# EasyEDA schematic Smart Controler Lolin D32.json
TITLE: Main Schematics; REV: 1.0; Date: 2019-06-09; Sheet: 1/1; Drawn By: Clément TOCHE; Company: Toche Corp
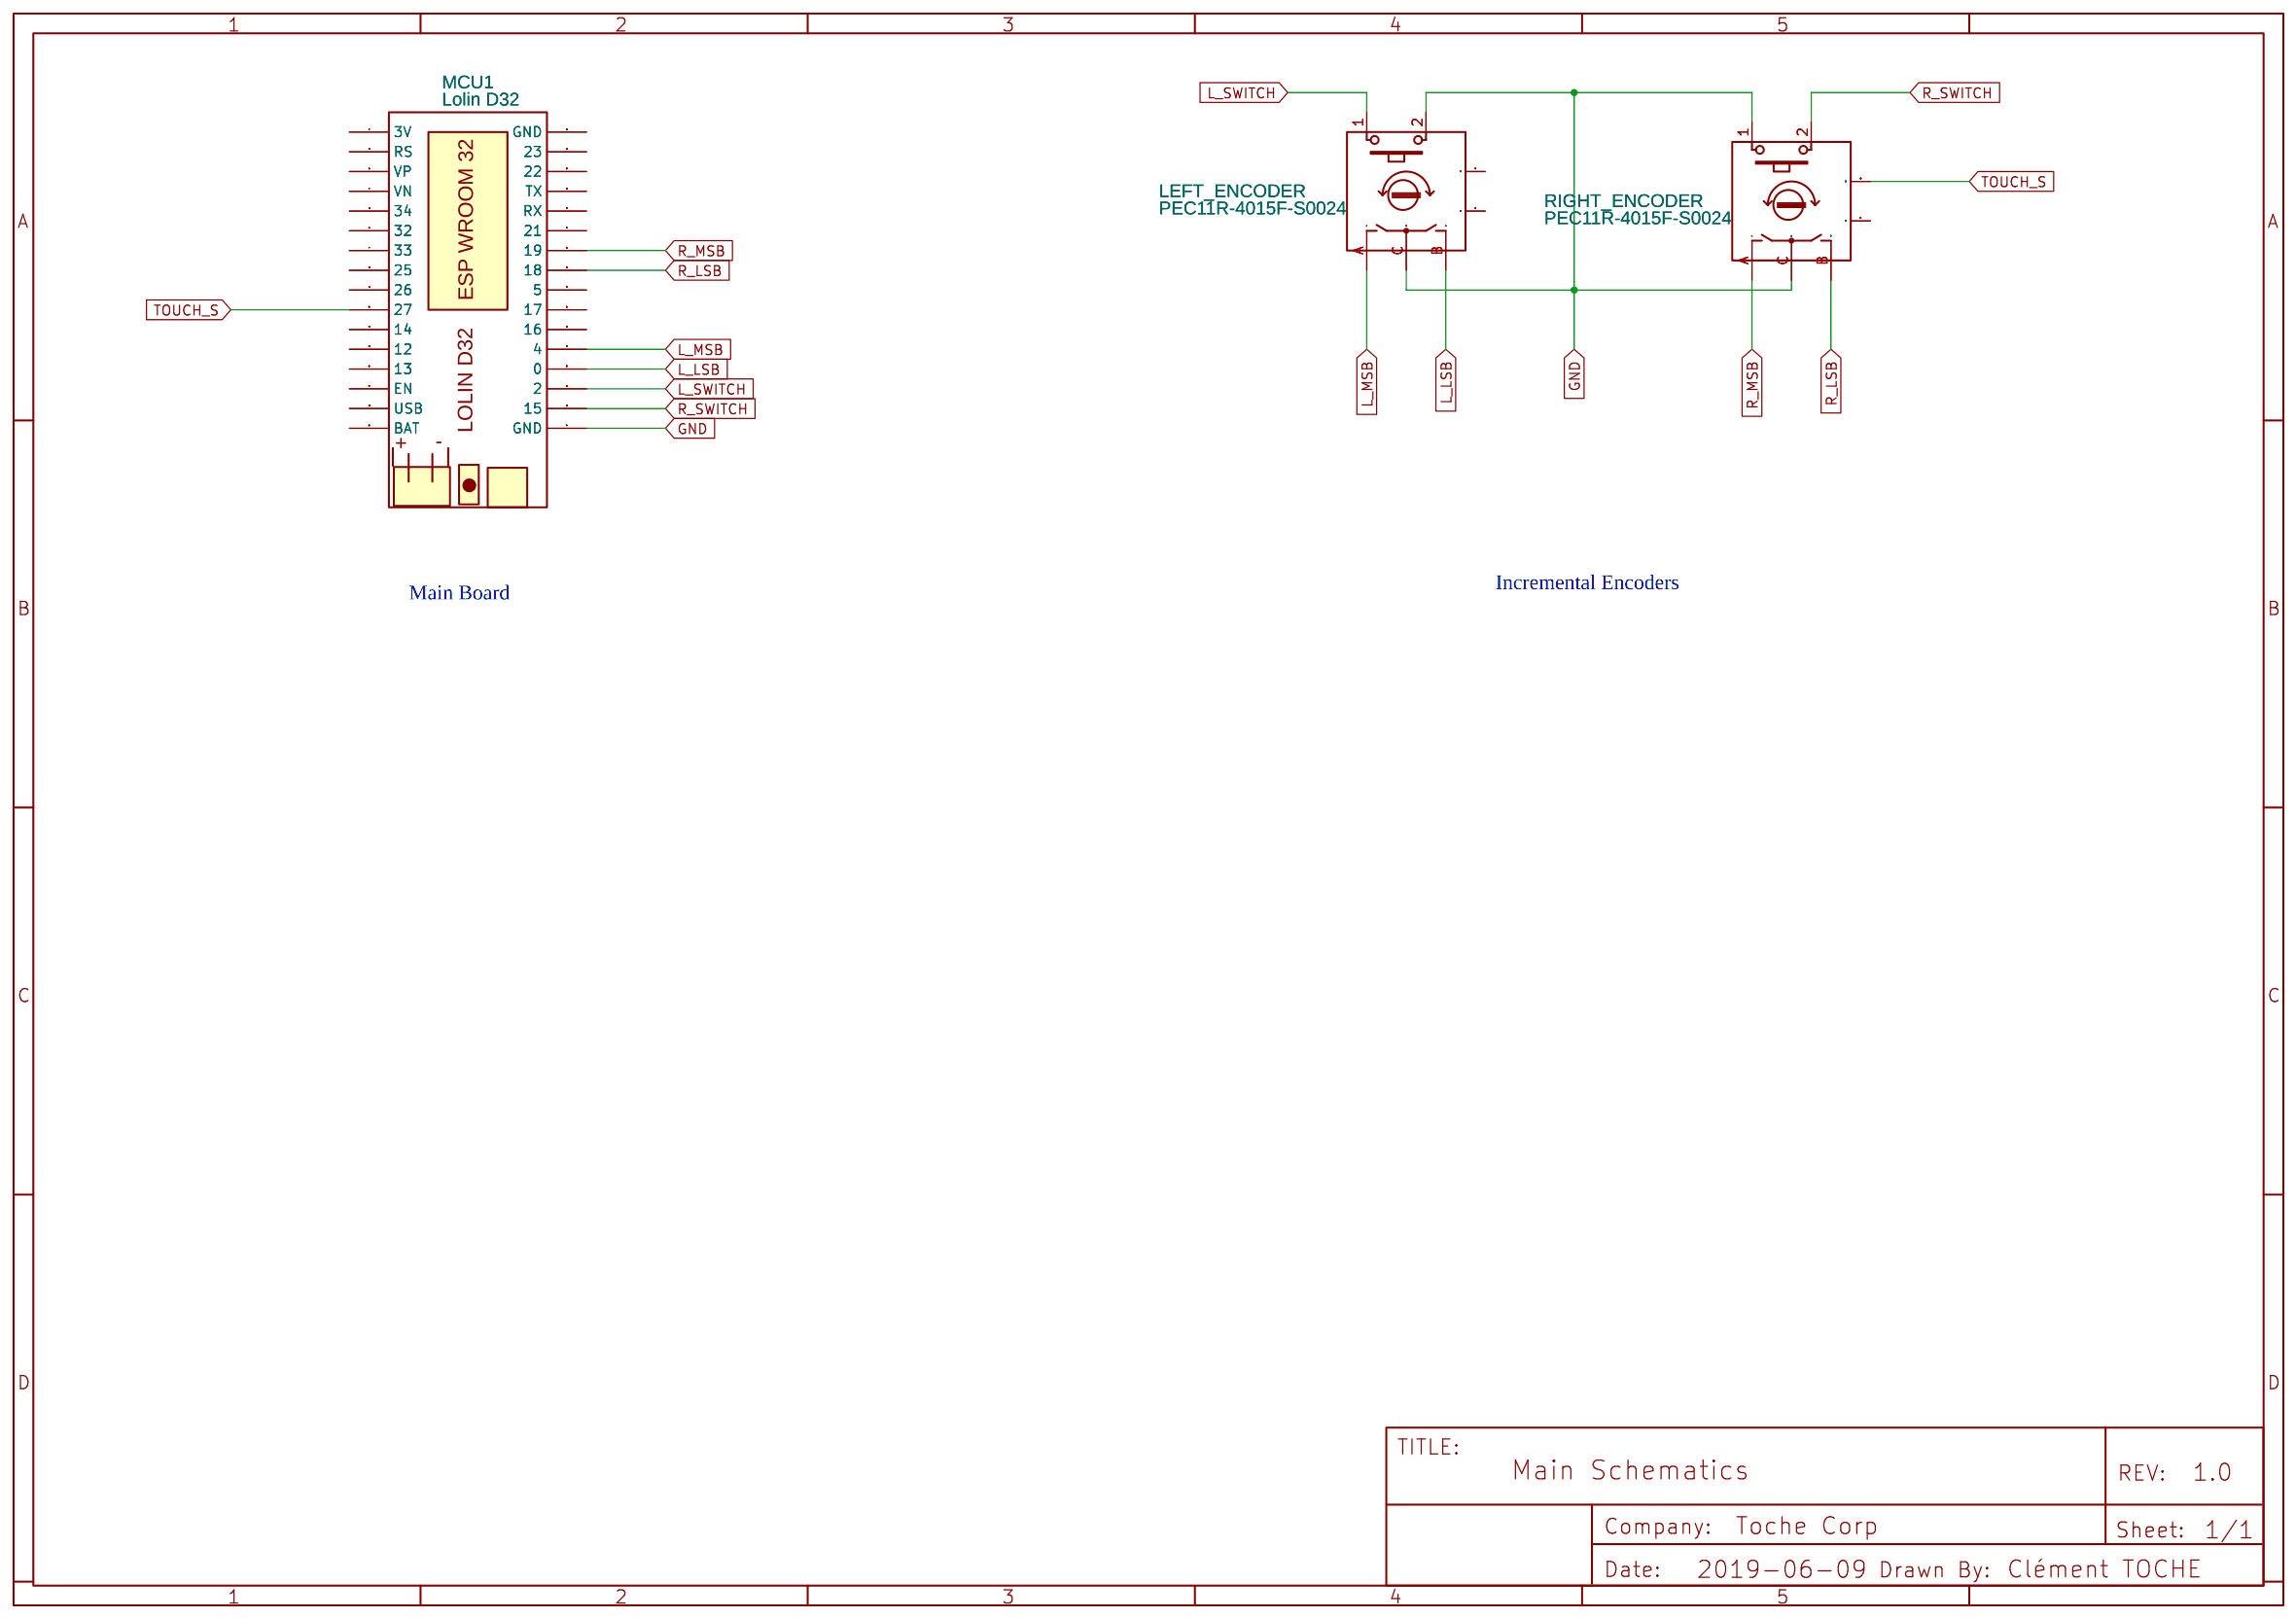
[diagram p0: schematic sheet]

## Parts
LEFT_ENCODER  PEC11R-4015F-S0024  [BOURNS_PEC11R-4XXXF-SXXXX]
MCU1  Lolin D32  [LOLIN D32]
RIGHT_ENCODER  PEC11R-4015F-S0024  [BOURNS_PEC11R-4XXXF-SXXXX]

## Library data of the parts
LEFT_ENCODER RIGHT_ENCODER = -: Supplier: LCSC; Supplier Part: C143789; Manufacturer: BOURNS; Contributor: LCSC
MCU1 = -: Manufacturer Part: New SchematicLib; Contributor: Fernando Abreu; Supplier: Espressif, Wemos

## Nets
GND: LEFT_ENCODER.2 LEFT_ENCODER.C MCU1.17(GND) RIGHT_ENCODER.1 RIGHT_ENCODER.C
L_LSB: LEFT_ENCODER.B MCU1.20(0)
L_MSB: LEFT_ENCODER.A MCU1.21(4)
L_SWITCH: LEFT_ENCODER.1 MCU1.19(2)
R_LSB: MCU1.25(18) RIGHT_ENCODER.B
R_MSB: MCU1.26(19) RIGHT_ENCODER.A
R_SWITCH: MCU1.18(15) RIGHT_ENCODER.2
TOUCH_S: MCU1.10(27) RIGHT_ENCODER.MT2

Not connected (* = marked no-connect by the designer): LEFT_ENCODER MT1 MT2; MCU1 1(3V) 2(RS) 3(VP) 4(VN) 5(34) 6(32) 7(33) 8(25) 9(26) 11(14) 12 13 14(EN) 15(USB) 16(BAT) 22(16) 23(17) 24(5) 27(21) 28(RX) 29(TX) 30(22) 31(23) 32(GND); RIGHT_ENCODER MT1

## Notes on the sheet
- Incremental Encoders
- Main Board
